# Altium schematic sheet DSD_SDR_Module.SchDoc
size A4; SheetNumber: 1; SheetTotal: 2
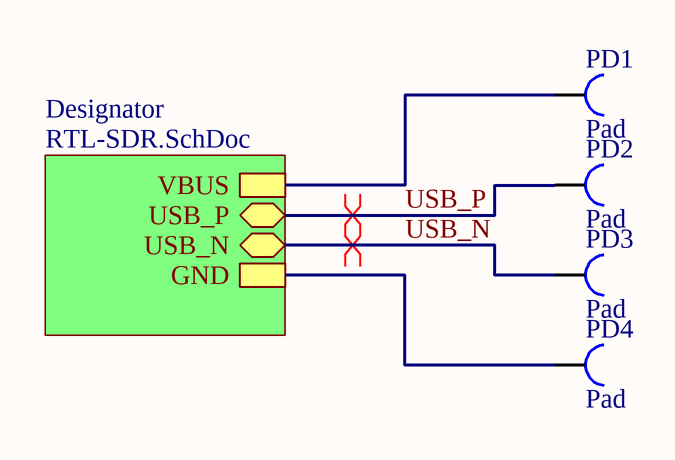
[diagram p0: DSD_SDR_Module.SchDoc]

## Parts
PD1  Pad  [pad]
PD2  Pad  [pad]
PD3  Pad  [pad]
PD4  Pad  [pad]

## Sub-sheets
Designator = RTL-SDR.SchDoc: USB_N (bidir), USB_P (bidir), GND, VBUS

## Nets
USB_N: PD3.1 ; sheet Designator/USB_N
USB_P: PD2.1 ; sheet Designator/USB_P
NetPD1_1: PD1.1 ; sheet Designator/VBUS
NetPD4_1: PD4.1 ; sheet Designator/GND

## Layout directives
differential pair: USB_N, USB_P